# Altium schematic sheet AudioAmp.SchDoc
size A; SheetNumber: 2; SheetTotal: 7
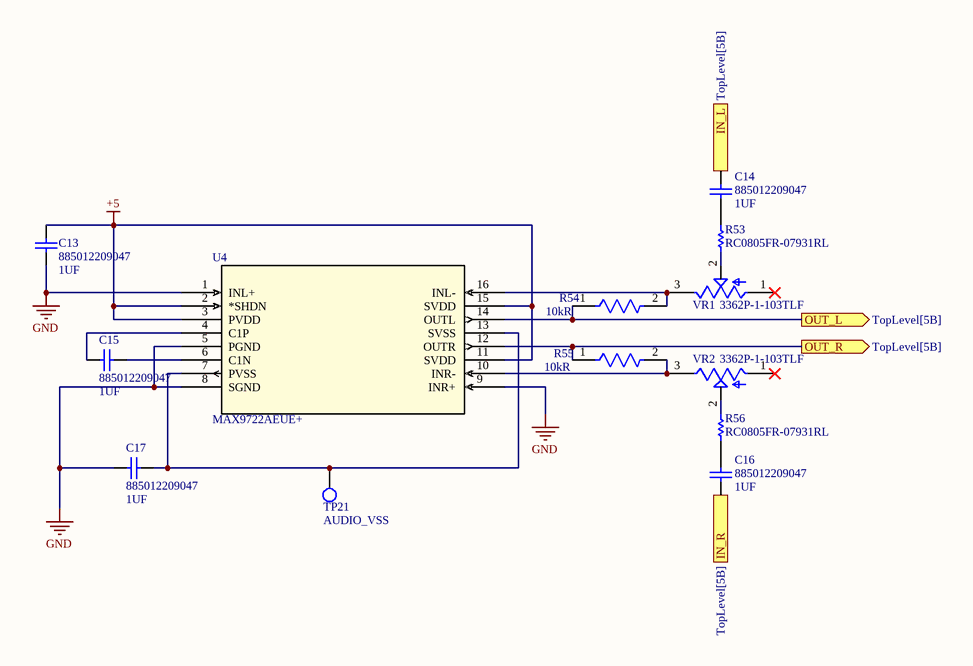
[diagram p0: AudioAmp.SchDoc]

## Parts
C13  885012209047  value 1UF  [1210]
C14  885012209047  value 1UF  [1210]
C15  885012209047  value 1UF  [1210]
C16  885012209047  value 1UF  [1210]
C17  885012209047  value 1UF  [1210]
R53  RC0805FR-07931RL  [RESC2013X60X35ML10T20]
R54  Resistance: 10kR  [FP-RC0603-0_55-IPC_C]  (hidden comment: RC0603FR-0710KL)
R55  Resistance: 10kR  [FP-RC0603-0_55-IPC_C]  (hidden comment: RC0603FR-0710KL)
R56  RC0805FR-07931RL  [RESC2013X60X35ML10T20]
TP21  AUDIO_VSS  [TP-PAD]
U4  MAX9722AEUE+  [21-0066J_16]
VR1  3362P-1-103TLF  [TRIM_3362P-1-103TLF]
VR2  3362P-1-103TLF  [TRIM_3362P-1-103TLF]

## Ports
IN_L (in, see TopLevel[5B]), IN_R (in, see TopLevel[5B]), OUT_L (out, see TopLevel[5B]), OUT_R (out, see TopLevel[5B])

## Nets
+5: C13.1 U4.2(*SHDN) U4.3(PVDD) U4.11(SVDD) U4.15(SVDD)
GND: C13.2 C17.2 U4.1(INL+) U4.5(PGND) U4.8(SGND) U4.9(INR+)
IN_L: C14.1 ; port IN_L
IN_R: C16.1 ; port IN_R
OUT_L: R54.1 U4.14(OUTL) ; port OUT_L
OUT_R: R55.1 U4.12(OUTR) ; port OUT_R
NetC14_2: C14.2 R53.2
NetC15_1: C15.1 U4.6(C1N)
NetC15_2: C15.2 U4.4(C1P)
NetC16_2: C16.2 R56.1
NetC17_1: C17.1 TP21.1 U4.7(PVSS) U4.13(SVSS)
NetR53_1: R53.1 VR1.2(WIPER)
NetR54_2: R54.2 U4.16(INL-) VR1.3(CW)
NetR55_2: R55.2 U4.10(INR-) VR2.3(CW)
NetR56_2: R56.2 VR2.2(WIPER)

Not connected (* = marked no-connect by the designer): VR1 1(CCW)*; VR2 1(CCW)*

## Library data of the parts
C13-C17 = CAP CER 1UF 50V X7R 1210: Capacitor; Designator: C?; Voltage Rating: 50V; Published: 8-Jun-2000; LatestRevisionDate: 17-Jul-2002; LatestRevisionNote: Re-released for DXP Platform.; Publisher: Altium Limited; Manufacturer Part Number: 885012209047
R53 R56 = CMP-2001-01307-1: Manufacturer: Yageo; Part Number: RC0805FR-07931RL
R54 R55 = CMP-2100-03664-2: RES 10K OHM 1% 1/10W 0603; Voltage Rating: 75V; Voltage Rating (DC): 50V; Power Rating: 100mW; Temperature Coefficient: 100ppm/°C; Depth: 0.8mm; Termination: SMD/SMT; Resistor Type: Thick Film; Series: RC; Construction: Rectangular; Features: Moisture Resistant; Packaging: Tape and Reel; Min Operating Temperature: -55°C; Number of Terminations: 2; Lead Pitch: 0.3mm; RoHS Compliant: Yes; Case/Package: 0603; Resistance Tolerance: 1%; Military Standard: Not; Weight: 7.1E-05oz; Number of Pins: 2; Tolerance: 1%; Length: 1.6mm; Case Code (Imperial): 0603; Lead Free: Lead Free; Width: 0.8mm; Max Power Dissipation: 100mW; Height: 0.45mm; Max Operating Temperature: 155°C; Case Code (Metric): 1608; Size Code: 0603
TP21 = TP-PAD
U4 = MAX9722AEUE+: No Description Available; Mfr_Name: Analog Devices Inc; RefDes: RefDes; Type: Type
VR1 VR2 = 3362P-1-103TLF: 10 kOhms 0.5W, 1/2W PC Pins Through Hole Trimmer Potentiometer Cermet 1 Turn Top Finger Adjustment; MF: Bourns; SnapEDA_Link: https://www.snapeda.com/parts/3362P-1-103TLF/Bourns/view-part/282422/?ref=snap; MP: 3362P-1-103TLF; Package: 3362P-1-T Bourns Inc.; Check_prices: https://www.snapeda.com/parts/3362P-1-103TLF/Bourns/view-part/282422/?ref=eda; Value: *; Purchase-URL: https://pricing.snapeda.com/search/part/3362P-1-103TLF/?ref=eda; Digi-Key_Part_Number: 3362P-103TLF-ND